# EAGLE design Adafruit Motor HAT rev A (EAGLE 6.4)

## Sheet 1 of 2
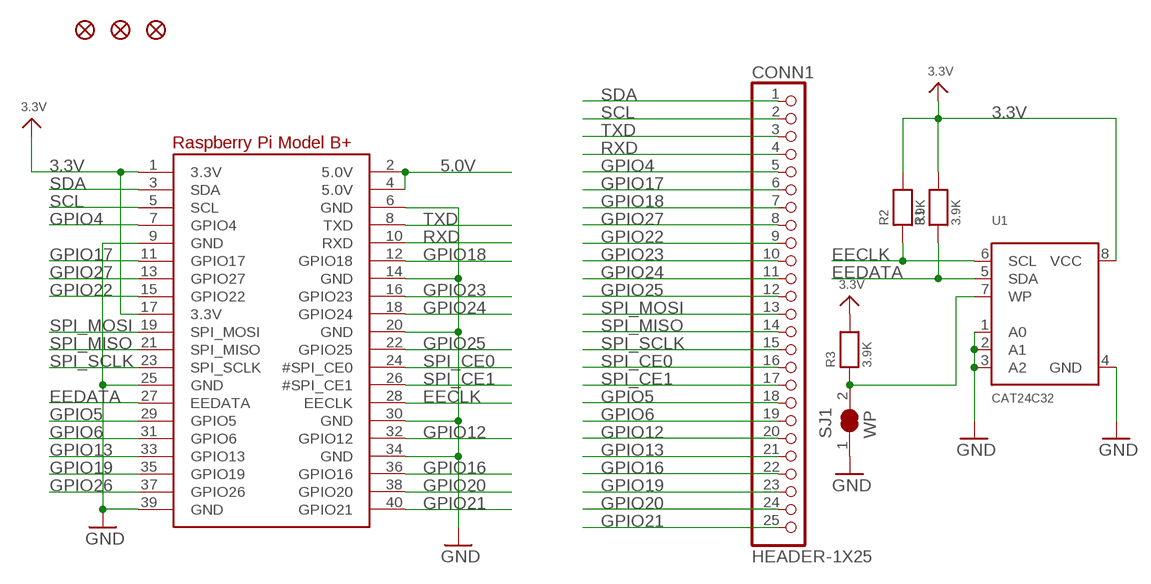
[diagram p0: schematic, sheet 1]

### Parts
CONN1  HEADER-1X25  [1X25_ROUND_70MIL]
FID1  FIDUCIAL""  [FIDUCIAL_1MM]
FID2  FIDUCIAL""  [FIDUCIAL_1MM]
FID3  FIDUCIAL""  [FIDUCIAL_1MM]
R1  3.9K  RESISTOR0805_NOOUTLINE  [0805-NO]
R2  3.9K  RESISTOR0805_NOOUTLINE  [0805-NO]
R3  3.9K  RESISTOR0805_NOOUTLINE  [0805-NO]
RPI1  RASPBERRYPI_BPLUS_HATSLOTS  [PI_HAT_SLOTS]
SJ1  WP  SOLDERJUMPER_CLOSED  [SOLDERJUMPER_CLOSEDWIRE]
U1  CAT24C32  EEPROM_I2C_SOIC8_GENERIC  [SOIC8_150MIL]

### Nets
3.3V: R1.2 R2.2 R3.2 RPI1.1(3.3V) RPI1.17(3.3V) U1.8(VCC) ; also sheet 2
5.0V: RPI1.2(5.0V) RPI1.4(5.0V)
EECLK: R2.1 RPI1.28(EECLK) U1.6(SCL)
EEDATA: R1.1 RPI1.27(EEDATA) U1.5(SDA)
GND: RPI1.6(GND) RPI1.9(GND) RPI1.14(GND) RPI1.20(GND) RPI1.25(GND) RPI1.30(GND) RPI1.34(GND) RPI1.39(GND) SJ1.1 U1.1(A0) U1.2(A1) U1.3(A2) U1.4(GND) ; also sheet 2
GPIO4: CONN1.5 RPI1.7(GPIO4)
GPIO5: CONN1.18 RPI1.29(GPIO5)
GPIO6: CONN1.19 RPI1.31(GPIO6)
GPIO12: CONN1.20 RPI1.32(GPIO12)
GPIO13: CONN1.21 RPI1.33(GPIO13)
GPIO16: CONN1.22 RPI1.36(GPIO16)
GPIO17: CONN1.6 RPI1.11(GPIO17)
GPIO18: CONN1.7 RPI1.12(GPIO18)
GPIO19: CONN1.23 RPI1.35(GPIO19)
GPIO20: CONN1.24 RPI1.38(GPIO20)
GPIO21: CONN1.25 RPI1.40(GPIO21)
GPIO22: CONN1.9 RPI1.15(GPIO22)
GPIO23: CONN1.10 RPI1.16(GPIO23)
GPIO24: CONN1.11 RPI1.18(GPIO24)
GPIO25: CONN1.12 RPI1.22(GPIO25)
GPIO26: RPI1.37(GPIO26)
GPIO27: CONN1.8 RPI1.13(GPIO27)
N$16: R3.1 SJ1.2 U1.7(WP)
RXD: CONN1.4 RPI1.10(RXD)
SCL: CONN1.2 RPI1.5(SCL) ; also sheet 2
SDA: CONN1.1 RPI1.3(SDA) ; also sheet 2
SPI_CE0: CONN1.16 RPI1.24(#SPI_CE0)
SPI_CE1: CONN1.17 RPI1.26(#SPI_CE1)
SPI_MISO: CONN1.14 RPI1.21(SPI_MISO)
SPI_MOSI: CONN1.13 RPI1.19(SPI_MOSI)
SPI_SCLK: CONN1.15 RPI1.23(SPI_SCLK)
TXD: CONN1.3 RPI1.8(TXD)

## Sheet 2 of 2
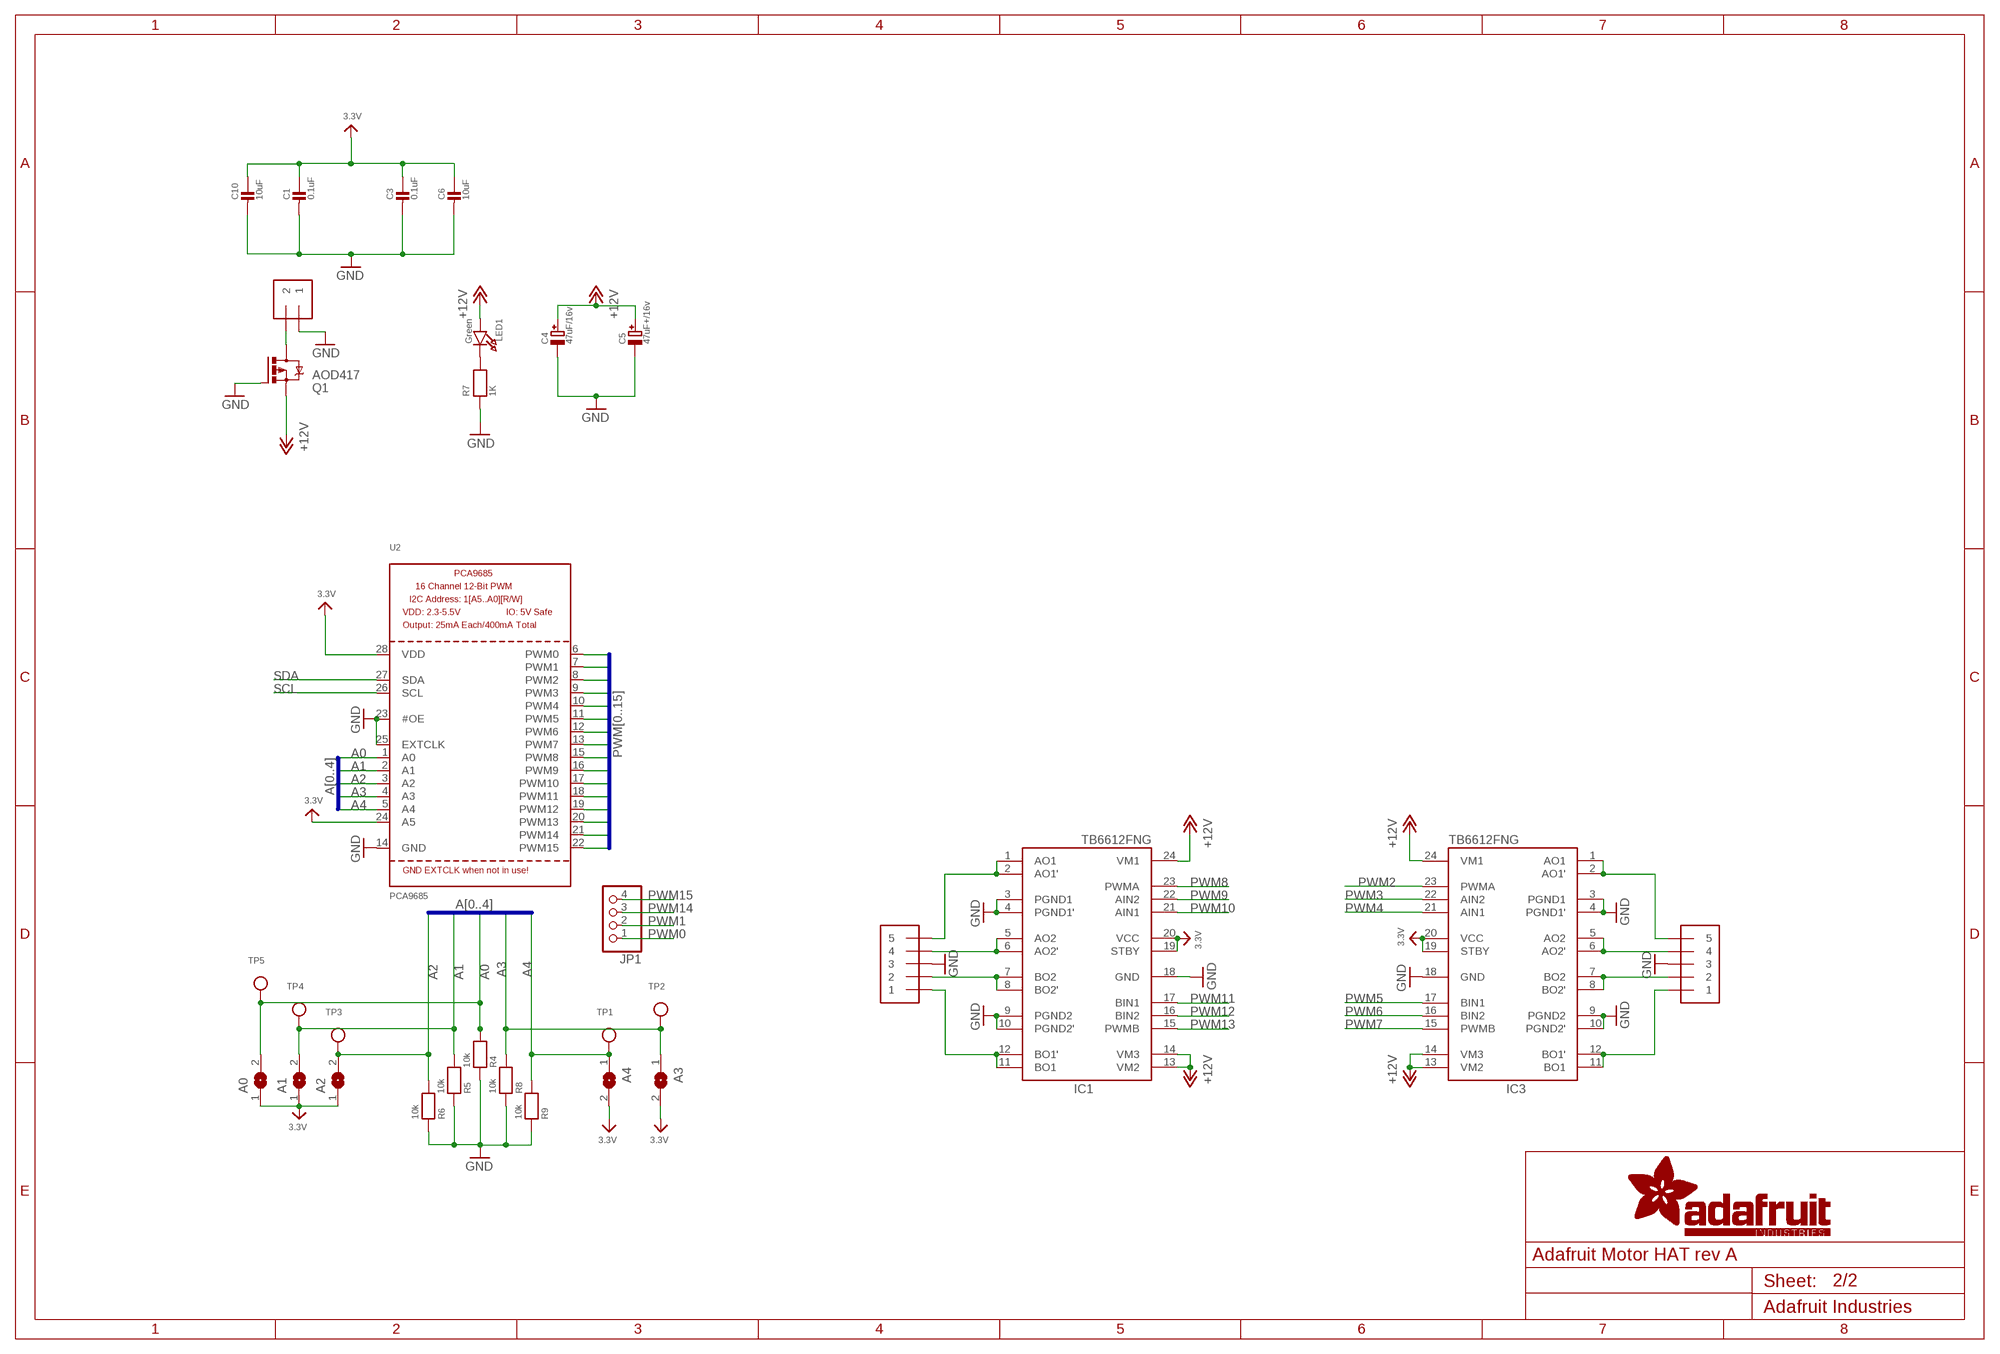
[diagram p1: schematic, sheet 2]

### Parts
A0  SOLDERJUMPERREFLOW_NOPASTE  [SOLDERJUMPER_REFLOW_NOPASTE]
A1  SOLDERJUMPERREFLOW_NOPASTE  [SOLDERJUMPER_REFLOW_NOPASTE]
A2  SOLDERJUMPERREFLOW_NOPASTE  [SOLDERJUMPER_REFLOW_NOPASTE]
A3  SOLDERJUMPERREFLOW_NOPASTE  [SOLDERJUMPER_REFLOW_NOPASTE]
A4  SOLDERJUMPERREFLOW_NOPASTE  [SOLDERJUMPER_REFLOW_NOPASTE]
C1  0.1uF  CAP_CERAMIC0805-NOOUTLINE  [0805-NO]
C3  0.1uF  CAP_CERAMIC0805-NOOUTLINE  [0805-NO]
C4  47uF/16v  CAP_ELECTROLYTICPANASONIC_C  [PANASONIC_C]
C5  47uF+/16v  CAP_ELECTROLYTICPANASONIC_C  [PANASONIC_C]
C6  10uF  CAP_CERAMIC0805-NOOUTLINE  [0805-NO]
C10  10uF  CAP_CERAMIC0805-NOOUTLINE  [0805-NO]
IC1  TB6612FNG  [SSOP24]
IC3  TB6612FNG  [SSOP24]
J1  1X5  [1X05-3.5MM]
J3  1X5  [1X05-3.5MM]
JP1  HEADER-1X476MIL  [1X04_ROUND_76]
LED1  Green  LED0805_NOOUTLINE  [CHIPLED_0805_NOOUTLINE]
MPOWER  1X2-3.5MM  [1X2-3.5MM]
Q1  AOD417  IRFR5305  [D-PAK_TO252AA]
R4  10k  RESISTOR0805_NOOUTLINE  [0805-NO]
R5  10k  RESISTOR0805_NOOUTLINE  [0805-NO]
R6  10k  RESISTOR0805_NOOUTLINE  [0805-NO]
R7  1K  RESISTOR0805_NOOUTLINE  [0805-NO]
R8  10k  RESISTOR0805_NOOUTLINE  [0805-NO]
R9  10k  RESISTOR0805_NOOUTLINE  [0805-NO]
TP1  TESTPOINTROUND2MM  [TESTPOINT_ROUND_2MM]
TP2  TESTPOINTROUND2MM  [TESTPOINT_ROUND_2MM]
TP3  TESTPOINTROUND2MM  [TESTPOINT_ROUND_2MM]
TP4  TESTPOINTROUND2MM  [TESTPOINT_ROUND_2MM]
TP5  TESTPOINTROUND2MM  [TESTPOINT_ROUND_2MM]
U2  PCA9685  [TSSOP28]

### Nets
3.3V: A0.1 A1.1 A2.1 A3.2 A4.2 C1.1 C3.1 C6.1 C10.1 IC1.19(STBY) IC1.20(VCC) IC3.19(STBY) IC3.20(VCC) U2.24(A5) U2.28(VDD) ; also sheet 1
+12V: C4.+ C5.+ IC1.13(VM2) IC1.14(VM3) IC1.24(VM1) IC3.13(VM2) IC3.14(VM3) IC3.24(VM1) LED1.A Q1.3(S)
A0: A0.2 R4.2 TP5.P$1 U2.1(A0)
A1: A1.2 R5.2 TP4.P$1 U2.2(A1)
A2: A2.2 R6.2 TP3.P$1 U2.3(A2)
A3: A3.1 R8.2 TP2.P$1 U2.4(A3)
A4: A4.1 R9.2 TP1.P$1 U2.5(A4)
GND: C1.2 C3.2 C4.- C5.- C6.2 C10.2 IC1.3(PGND1) IC1.4(PGND1') IC1.9(PGND2) IC1.10(PGND2') IC1.18(GND) IC3.3(PGND1) IC3.4(PGND1') IC3.9(PGND2) IC3.10(PGND2') IC3.18(GND) J1.3 J3.3 MPOWER.1 Q1.1(G) R4.1 R5.1 R6.1 R7.1 R8.1 R9.1 U2.14(GND) U2.23(#OE) U2.25(EXTCLK) ; also sheet 1
N$3: MPOWER.2 Q1.4(D)
N$4: IC1.1(AO1) IC1.2(AO1') J1.5
N$6: IC1.5(AO2) IC1.6(AO2') J1.4
N$7: IC1.7(BO2) IC1.8(BO2') J1.2
N$9: IC1.11(BO1) IC1.12(BO1') J1.1
N$12: IC3.1(AO1) IC3.2(AO1') J3.5
N$14: IC3.5(AO2) IC3.6(AO2') J3.4
N$15: IC3.7(BO2) IC3.8(BO2') J3.2
N$17: IC3.11(BO1) IC3.12(BO1') J3.1
N$133: LED1.C R7.2
PWM0: JP1.1 U2.6(PWM0)
PWM1: JP1.2 U2.7(PWM1)
PWM2: IC3.23(PWMA) U2.8(PWM2)
PWM3: IC3.22(AIN2) U2.9(PWM3)
PWM4: IC3.21(AIN1) U2.10(PWM4)
PWM5: IC3.17(BIN1) U2.11(PWM5)
PWM6: IC3.16(BIN2) U2.12(PWM6)
PWM7: IC3.15(PWMB) U2.13(PWM7)
PWM8: IC1.23(PWMA) U2.15(PWM8)
PWM9: IC1.22(AIN2) U2.16(PWM9)
PWM10: IC1.21(AIN1) U2.17(PWM10)
PWM11: IC1.17(BIN1) U2.18(PWM11)
PWM12: IC1.16(BIN2) U2.19(PWM12)
PWM13: IC1.15(PWMB) U2.20(PWM13)
PWM14: JP1.3 U2.21(PWM14)
PWM15: JP1.4 U2.22(PWM15)
SCL: U2.26(SCL) ; also sheet 1
SDA: U2.27(SDA) ; also sheet 1

### Buses
PWM[0..15]
A[0..4]

## Library data of the parts
A0 A1-A4 = microbuilder:SOLDERJUMPER: SMD Solder JUMPER Solder the two pads together to create a connection, or remove the solder to break it. REFLOW - Use this footprint for solder paste and reflow ovens. WAVE - Use this footprint for hand-soldering (larger pads). CLOSED - Has a trace between the two pads to ensure it is closed by default. The trace needs to be cut to disable the jumper, and can be closed again by creating a solder bridge between the two pads.
C1 C3 C6 C10 = microbuilder:CAP_CERAMIC: Ceramic Capacitors For new designs, use the packages preceded by an '_' character since they are more reliable: The following footprints should be used on most boards: _0402 - Standard footprint for regular board layouts _0603 - Standard footprint for regular board layouts _0805 - Standard footprint for regular board layouts For extremely tight-pitch boards where space is at a premium, the following 'micro-pitch' footprints can be used (smaller pads, no silkscreen outline, etc.): _0402MP - Micro-pitch footprint for very dense/compact boards _0603MP - Micro-pitch footprint for very dense/compact boards _0805MP - Micro-pitch footprint for very dense/compact boards Commonly Stocked Parts 0402 - 0402 Surface Mount Capacitors 16pF 50V 5% [Digikey: 445-4899-2-ND] 18pF 50V 5% [Digikey: 490-1281-2-ND] 22pF 50V 5% [Digikey: 490-1283-2-ND] 68pF 50V 5% [Digikey: 490-1289-2-ND] 0.1uF 10V 10% [Digikey: 490-1318-2-ND] 1.0uF 6.3V 10% [Digikey: 490-1320-2-ND] 0603 - 0603 Surface Mount Capacitors 16 pF 50V 5% [Digikey: 445-5051-2-ND] 22 pF 50V [Digikey: PCC220ACVTR-ND] 33 pF 50V 5% [Digikey: 490-1415-1-ND] 56pF 50V 5% [Digikey: 490-1421-1-ND] 220pF 50V 5% [Digikey: 445-1285-1-ND] 680 pF 50V 2200 pF 50V 5% C0G [Digikey: 445-1297-1-ND] 5600 pF 100V 5% X7R [Digikey: 478-3711-1-ND] 0.1 µF 25V 10% [Digikey: PCC2277TR-ND] 0.22 µF 16V 10% X7R [Digikey: 445-1318-1-ND] 1.0 µF 25V 10% [Digikey: 445-5146-2-ND] 0603 - RF Specific 3pF 250V +/-0.1pF RF [Digikey: 712-1347-1-ND] 18 pF 250V 5% [Digikey: 478-3505-1-ND or 712-1322-1-ND] 56 pF 250V 5% C0G RF [Digikey: 490-4867-1-ND] 68 pF 250V RF [Digikey: 490-4868-1-ND] 0805 - 0805 Surface Mount Capacitors 220 pF 250V 2% RF Ceramic Capacitor [Digikey: 712-1398-1-ND] 1000 pF 50V 2% NP0 Ceramic Capacitor [Digikey: 478-3760-1-ND] 0.1 µF 25V 10% Ceramic Capacitor [Digikey: PCC1828TR-ND] 1.0 µF 16V 10% Ceramic Capacitor[Digikey: 490-1691-2-ND] 10.0 µF 10V 10% Ceramic Capacitor[Digikey: 709-1228-1-ND] 10.0 uF 16V 10% Ceramic Capacitor [Digikey: 478-5165-2-ND] 47 uF 6.3V 20% Ceramic Capacitor [Digikey: 587-1779-1-ND or 399-5506-1-ND] 1206 - 1206 Surface Mount Capacitors 47uF 10V 20% Ceramic Capacitor [Digikey: 490-5528-1-ND or 399-5508-1-ND or 445-6010-1-ND] 100uF 6.3V -20%, +80% Y5V Ceramic Capacitor (Digikey: 490-4512-1-ND, Mouser: 81-GRM31CF50J107ZE1L)
C4 C5 = microbuilder:CAP_ELECTROLYTIC: Electrolytic Capacitors SMT PANASONIC_C - Size C Panasonic Electrolytic Aluminum Capacitor 47µF 16V 20% Electrolytic Capacitor [Digikey: PCE3890TR-ND] PANASONIC_D - Size D Panasonic Electrolytic Aluminum Capacitor 100µF 25V 20% Electrolytic Capacitor [Digikey: PCE3898TR-ND] PTH 3.5 mm grid, 8 mm diameter ... 3.5 mm grid, 10 mm diameter ...
CONN1 = microbuilder:HEADER-1X25
FID1-FID3 = microbuilder:FIDUCIAL: Fiducial Alignment Points Various fiducial points for machine vision alignment.; BOM: EXCLUDE
IC1 IC3 = adafruit:TB6612FNG: TB6612FNG MOS dual H-bridge motor driver, 1.2A current 3.2A peak 3 or 5v logic and 3-15v motor
J1 J3 = adafruit:1X5
JP1 = microbuilder:HEADER-1X4: PIN HEADER
LED1 = microbuilder:LED: LED 0603 - 0603 Surface Mount Package 2mA: Green LED - Low Power (3.9mcd, 2ma, 1.7Vf) - Digikey: 475-2709-2-ND Orange LED - Low Power (9.8mcd, 2ma, 1.8Vf) - Digikey: 475-1194-2-ND Red LED - Low Power (5mcd, 2ma, 1.8Vf) - Digikey: 475-1195-2-ND Yellow LED - Low Power (7mcd, 2ma, 1.8Vf) - Digikey: 475-1196-2-ND 5mA: Blue LED - Low Power (17mcd, 5ma, 2.9Vf) - Digikey: LNJ937W8CRACT-ND 0805 - 0805 Surface Mount Package 2mA: Red LED (8.8mcd, 2mA, 1.8Vf, Clear) - Low Power [Digikey: 475-2510-1-ND] Green LED (5mcd, 2mA, 1.8Vf, Clear) - Low Power [Digikey: 475-2730-1-ND] Yellow LED (11.3mcd, 2mA, 1.8Vf, Clear) - Low Power [Digikey: 475-2555-1-ND] 20mA: Red LED (104mcd, 20mA, Diffused) - LS R976 [Digikey: 475-1278-6-ND] Red LED (12mcd, 20mA, 2.0Vf, Clear) - APT2012EC [Digikey: 754-1128-1-ND] Green LED (15mcd, 20mA, 2.2Vf, Clear) - APT2012GC [Digikey: 754-1131-1-ND] Orange LED (160mcd, 20mA, 2.1Vf, Clear) - APT2012SECK [Digikey: 754-1130-1-ND] 1206 - 1206 Surface Mount Package Green LED (26mcd, 20mA, Diffused) - LG N971 [Digikey: 475-1407-6-ND] Red LED (15mcd, 20mA, Diffused) - LH N974 [Digikey: 475-1416-6-ND] Cree - Cree High-Power Surface Mount LEDs XPEBWT-L1-0000-00D50 - White 111lm 350mA 2.9Vf 6200K 110° XTEAWT-00-0000-00000LEE3 - White 114lm 350mA 2.85Vf 5000K 115° Everlight - Everlight 45-21 Series Surface Mount LEDs 45-21/QK2C-B2832AC2CB2/2T - Warm White 2000mcd 20mA 3.25Vf 3050K 120° 45-21/LK2C-B38452C4CB2/2T - Nuetral White 2000mcd 20mA 3.25Vf 4150K 120° 45-21/LK2C-B50634C6CB2/2T - Cold White 2200mcd 20mA 3.25Vf 5650K 120° PLCC2 Reverse Mount LS T77K-J1L2-1-0-2-R18-Z - Red 11.25mcd 2mA 1.8Vf 630nm 120° LO T77K-L1M2-24-Z - Orange 19.6mcd 2mA 1.8Vf 606nm 120° LY T77K-K2M1-26-Z - Yellow 15.7mcd 2mA 1.8Vf 587nm 120°
MPOWER = adafruit:1X2: 3.5mm Terminal block http://www.ladyada.net/library/pcb/eaglelibrary.html
Q1 = transistor-power:IRF?5305: HEXFET Power MOSFET Source: http://www.irf.com/product-info/datasheets/data/irfr5305pbf.pdf
R1-R9 = microbuilder:RESISTOR: Resistors For new designs, use the packages preceded by an '_' character since they are more reliable: The following footprints should be used on most boards: _0402 - Standard footprint for regular board layouts _0603 - Standard footprint for regular board layouts _0805 - Standard footprint for regular board layouts For extremely tight-pitch boards where space is at a premium, the following 'micro-pitch' footprints can be used (smaller pads, no silkscreen outline, etc.): _0402MP - Micro-pitch footprint for very dense/compact boards _0603MP - Micro-pitch footprint for very dense/compact boards _0805MP - Micro-pitch footprint for very dense/compact boards
RPI1 = microbuilder:RASPBERRYPI_BPLUS
SJ1 = microbuilder:SOLDERJUMPER_CLOSED: Solder Jumper - Closed These solder jumpers are closed by default CLOSEDWIRE - 10 mil trace between pads that can be cut and resoldered later CLOSEDPERM - 63 mil trace between pads for a permanent connection (used to 'bridge' two signals, a shameless hack for Eagle). Can double as a test point as well (no cream layer)
TP1-TP5 = microbuilder:TESTPOINT: Test Point Various test points for characterisation and PCB testing TESTPOINT_SMT - Compact Surface Mount Test Point [Digikey: 5016KTR-ND]
U1 = microbuilder:EEPROM_I2C_SOIC8_GENERIC: Note: The same pinout is used for many I2C EEPROMs in SOIC8(150mil) from a variety of manufacturers and in various sizes. Examples: 16K (2K x 8 Bit) I2C EEPROM 1.7-5.5V, 400KHz, -40°C-85°C Digikey: CAT24C16WI-GT3CT-ND 256K (32K x 8 Bit) I2C EEPROM 1.7-5.5V, 400KHz, -40°C-85°C Digikey: 24AA256-I/SN-ND
U2 = microbuilder:PCA9685: PCA9685 - 16 Channel 12-Bit I2C PWM Controller 5.0V tolerant 16 channel, 12-bit I2C PWM controller with 25mA per output (max. 400mA total) Digikey: 568-5931-1-ND

## Board
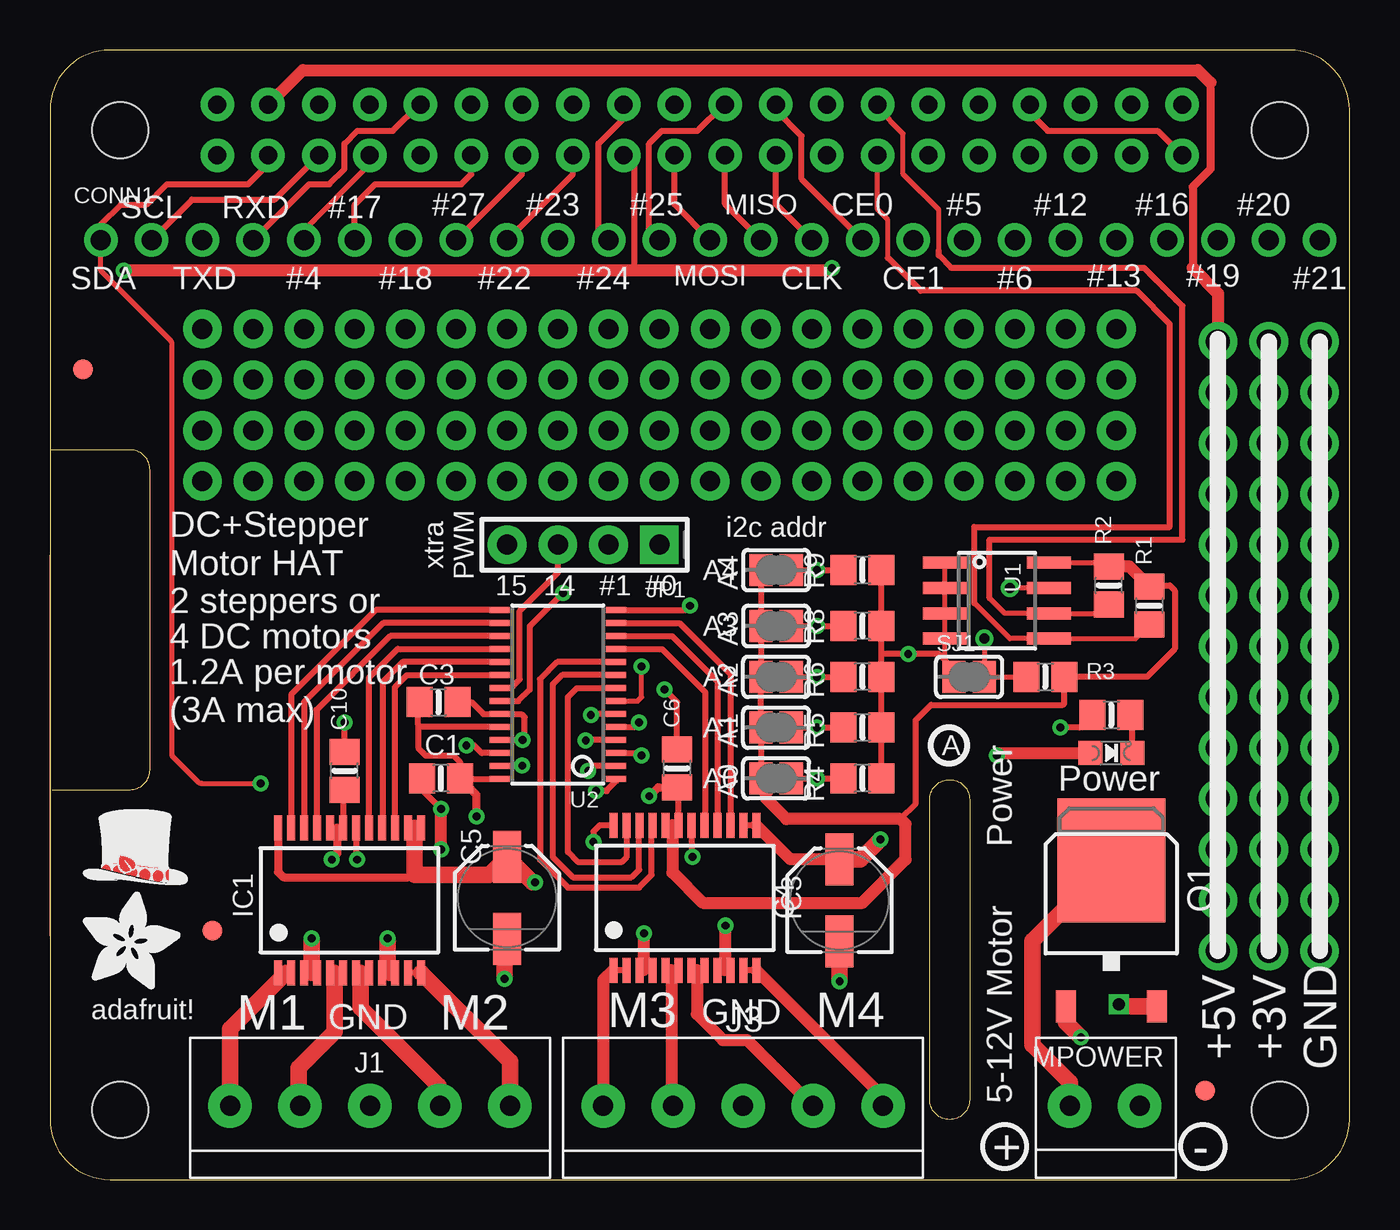
[diagram p2: board, top side]
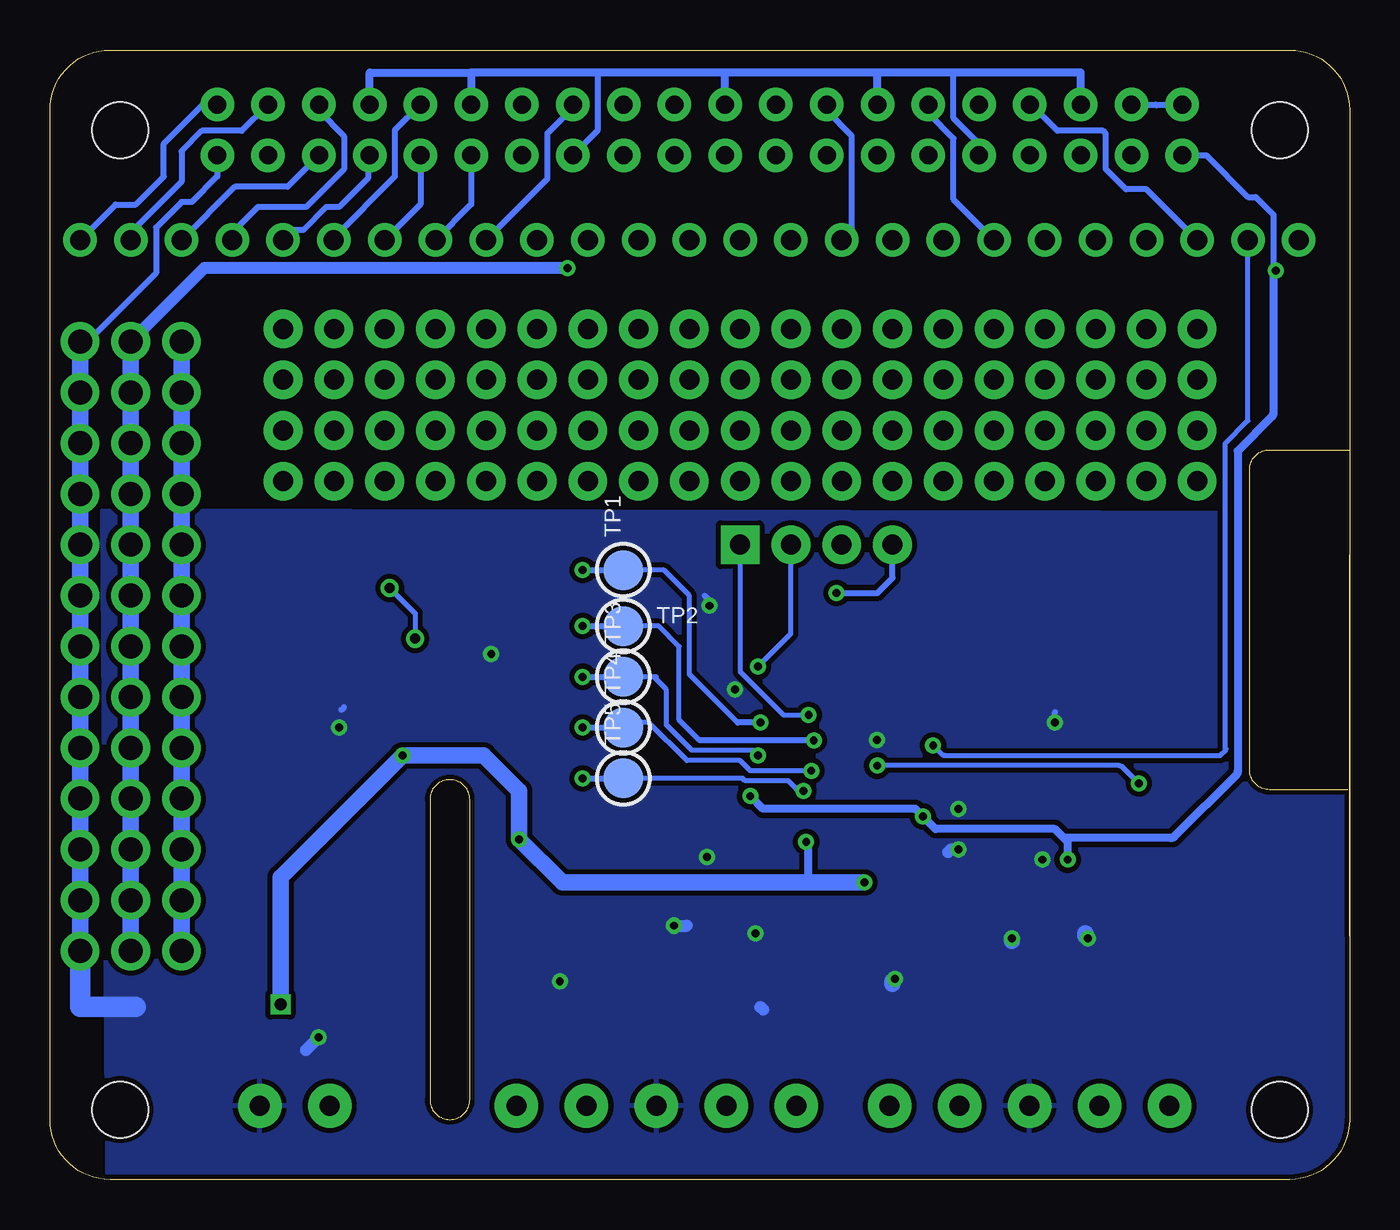
[diagram p3: board, bottom side, seen from below]

Size 65 x 56.5 mm. Coordinates in mm from the lower left corner, seen from the top.
Outline: 0,19.56 0,19.68
Outline: 0,12.19 0,31.24
Copper layers (1*16): Top 0.035mm / dielectric 1.5mm / Bottom 0.035mm
Design rules "adafruit *": minimum track width 8mil, minimum drill 15.5mil, track to track 8mil, track to pad 8mil, pad to pad 8mil, via to via 8mil, smd to smd 8mil, copper to edge 10mil, drill to drill 8mil, minimum pad ring 10mil, minimum via ring 8mil, stop-mask expansion 2mil, vias tented up to drill 20mil, thermal gap 10mil

### Footprints (pad centres in the part's own frame; a part is rotated, then mirrored left to right if it is on the bottom)
SOLDERJUMPER_REFLOW_NOPASTE = smd 1.168 x 1.6: 1 -0.762,0; 2 0.762,0
0805-NO = smd 1.3 x 1.5: 1 -0.95,0; 2 0.95,0
PANASONIC_C = smd 2.6 x 1.4: + 2.05,0; - -2.05,0
1X25_ROUND_70MIL = drill 1 pad 1.676: 1 -30.48,0; 2 -27.94,0; 3 -25.4,0; 4 -22.86,0; 5 -20.32,0; 6 -17.78,0; 7 -15.24,0; 8 -12.7,0; 9 -10.16,0; 10 -7.62,0; 11 -5.08,0; 12 -2.54,0; 13 0,0; 14 2.54,0; 15 5.08,0; 16 7.62,0; 17 10.16,0; 18 12.7,0; 19 15.24,0; 20 17.78,0; 21 20.32,0; 22 22.86,0; 23 25.4,0; 24 27.94,0; 25 30.48,0
FIDUCIAL_1MM = smd 1 x 1: 1 0,0
SSOP24 = smd 0.4 x 1.25: 1 -3.575,-3.625; 2 -2.925,-3.625; 3 -2.275,-3.625; 4 -1.625,-3.625; 5 -0.975,-3.625; 6 -0.325,-3.625; 7 0.325,-3.625; 8 0.975,-3.625; 9 1.625,-3.625; 10 2.275,-3.625; 11 2.925,-3.625; 12 3.575,-3.625; 13 3.575,3.625; 14 2.925,3.625; 15 2.275,3.625; 16 1.625,3.625; 17 0.975,3.625; 18 0.325,3.625; 19 -0.325,3.625; 20 -0.975,3.625; 21 -1.625,3.625; 22 -2.275,3.625; 23 -2.925,3.625; 24 -3.575,3.625
1X05-3.5MM = drill 1 pad 2.184: 1 7,0; 2 3.5,0; 3 0,0; 4 -3.5,0; 5 -7,0
1X04_ROUND_76 = drill 1 pad 1.93 square: 1 -3.81,0 | drill 1 pad 1.93: 2 -1.27,0; 3 1.27,0; 4 3.81,0
CHIPLED_0805_NOOUTLINE = smd 1.2 x 1.2: A 0,-1.05; C 0,1.05
1X2-3.5MM = drill 1 pad 2.184: 1 1.8,0; 2 -1.7,0
D-PAK_TO252AA = smd 1 x 1.6: 1 -2.28,-4.8; 3 2.28,-4.8 | smd 5.4 x 6.2: 4 0,2.5
PI_HAT_SLOTS = drill 0.9 pad 1.676: 1 8.37,51.23; 2 8.37,53.77; 3 10.91,51.23; 4 10.91,53.77; 5 13.45,51.23; 6 13.45,53.77; 7 15.99,51.23; 8 15.99,53.77; 9 18.53,51.23; 10 18.53,53.77; 11 21.07,51.23; 12 21.07,53.77; 13 23.61,51.23; 14 23.61,53.77; 15 26.15,51.23; 16 26.15,53.77; 17 28.69,51.23; 18 28.69,53.77; 19 31.23,51.23; 20 31.23,53.77; 21 33.77,51.23; 22 33.77,53.77; 23 36.31,51.23; 24 36.31,53.77; 25 38.85,51.23; 26 38.85,53.77; 27 41.39,51.23; 28 41.39,53.77; 29 43.93,51.23; 30 43.93,53.77; 31 46.47,51.23; 32 46.47,53.77; 33 49.01,51.23; 34 49.01,53.77; 35 51.55,51.23; 36 51.55,53.77; 37 54.09,51.23; 38 54.09,53.77; 39 56.63,51.23; 40 56.63,53.77 | hole 2.8: 3.5,3.5; 3.5,52.5; 61.5,52.5; 61.5,3.5
SOLDERJUMPER_CLOSEDWIRE = smd 1.168 x 1.6: 1 -0.762,0; 2 0.762,0 | smd 0.635 x 0.203: WIRE 0,0
TESTPOINT_ROUND_2MM = smd 2 x 2: P$1 0,0
SOIC8_150MIL = smd 0.6 x 2.2: 1 -1.905,-2.6; 2 -0.635,-2.6; 3 0.635,-2.6; 4 1.905,-2.6; 5 1.905,2.6; 6 0.635,2.6; 7 -0.635,2.6; 8 -1.905,2.6
TSSOP28 = smd 0.305 x 0.991: 1 -4.225,-2.918; 2 -3.575,-2.918; 3 -2.925,-2.918; 4 -2.275,-2.918; 5 -1.625,-2.918; 6 -0.975,-2.918; 7 -0.325,-2.918; 8 0.325,-2.918; 9 0.975,-2.918; 10 1.625,-2.918; 11 2.275,-2.918; 12 2.925,-2.918; 13 3.575,-2.918; 14 4.225,-2.918; 15 4.225,2.918; 16 3.575,2.918; 17 2.925,2.918; 18 2.275,2.918; 19 1.625,2.918; 20 0.975,2.918; 21 0.325,2.918; 22 -0.325,2.918; 23 -0.975,2.918; 24 -1.625,2.918; 25 -2.275,2.918; 26 -2.925,2.918; 27 -3.575,2.918; 28 -4.225,2.918

### Placement (x,y rotation side)
A0  36.32,20.07 0 top
A1  36.32,22.61 0 top
A2  36.32,25.15 0 top
A3  36.32,27.69 180 top
A4  36.32,30.48 180 top
C1  19.56,20.07 180 top
C3  19.43,23.88 0 top
C4  39.5,13.97 90 top
C5  22.86,14.1 90 top
C6  31.37,20.57 90 top
C10  14.73,20.45 90 top
CONN1  33.02,46.99 0 top
FID1  1.65,40.51 0 top
FID2  57.78,4.45 0 top
FID3  8.13,12.45 0 top
IC1  14.99,13.97 0 top
IC3  31.75,14.1 0 top
J1  16,3.68 0 top
J3  34.67,3.68 0 top
JP1  26.67,31.75 180 top
LED1  53.09,21.34 270 top
MPOWER  52.7,3.68 0 top
Q1  53.09,13.46 0 top
R1  54.99,28.7 90 top
R2  52.96,29.72 90 top
R3  49.78,25.15 0 top
R4  40.64,20.07 180 top
R5  40.64,22.61 180 top
R6  40.64,25.15 180 top
R7  53.09,23.24 0 top
R8  40.64,27.69 180 top
R9  40.64,30.48 180 top
RPI1  0,0 0 top
SJ1  45.97,25.15 0 top
TP1  36.32,30.48 90 bottom
TP2  36.32,27.69 0 bottom
TP3  36.32,25.15 90 bottom
TP4  36.32,22.61 90 bottom
TP5  36.32,20.07 90 bottom
U1  47.37,28.96 270 top
U2  25.4,24.26 90 top
U$5  [PIHATLOGO]  1.65,14.73 0 top
U$6  [PCBFEAT-REV-040]  44.96,21.72 0 top
U$51  [ADAFRUIT_5MM]  1.65,9.53 0 top

### Tracks (layer width: path | path; a pad name or v marks a point on that pad's centre or on a via)
3.3V  (via drill 0.39, 1.2 pad 1.93)
  Top 0.254: U1.8 52.77,30.86 R2.2 | 29.21,45.59 29.21,45.47
  Top 0.305: RPI1.17 29.21,50.71 29.21,45.59 | A4.2 A3.2 A2.1 A1.1 A0.1 | IC3.20 31.13,17.72 IC3.19 31.43,19.57 C6.1 | IC1.20 14.36,17.59 IC1.19 14.66,19.43 C10.1 | U2.24 18.52,22.63 18.41,22.73 | 18.41,22.73 18.41,23.81 C3.1 | U2.28 20.54,20.03 C1.1 20.51,20.89 20.19,21.21 18.8,21.21 18.41,21.59 18.41,22.73 | R1.2 55.06,29.72 56.01,29.72 56.26,29.46 56.26,26.54 54.86,25.15 R3.2 50.73,23.81 50.67,23.75 44.07,23.75 43.31,22.99 43.31,18.8 42.55,18.03
  Top 0.406: 14.36,17.59 14.36,16.26 v14.1,16 | v21.34,18.16 21.34,19.24 C1.1 | v29.97,19.18 30.42,19.62 C6.1
  Top 0.61: v3.68,45.47 29.21,45.47 38.99,45.47 v39.12,45.59 | R2.2 53.31,31.02 53.66,30.67 53.98,30.67 R1.2 | 31.13,17.72 31.13,15.36 32.64,13.84 40.64,13.84 42.8,16 42.8,17.78 42.55,18.03 36.83,18.03 35.81,19.05 35.81,19.81 A0.1 35.31,19.81
  Bottom 0.305: RPI1.1 7.16,51.23 5.08,49.15 4.7,49.15 3.81,48.26 3.81,45.47 v3.68,45.47 3.56,45.47 3.56,45.34
  Bottom 0.406: v14.1,16 14.1,16.89 14.29,17.08 | 14.29,17.08 14.73,17.53 20.7,17.53 v21.34,18.16 21.72,18.54 29.34,18.54 v29.97,19.18 | 3.81,45.47 3.81,38.33 arc45 3.88,38.15 5.59,36.45 5.59,20.43 arc45 5.66,20.25 8.75,17.16 arc45 8.93,17.08 14.29,17.08
  Bottom 0.61: v39.12,45.59 57.28,45.59 v60.96,41.91
  Bottom 0.813: v60.96,11.43 v60.96,13.97 v60.96,16.51 v60.96,19.05 v60.96,21.59 v60.96,24.13 v60.96,26.67 v60.96,29.21 v60.96,31.75 v60.96,34.29 v60.96,36.83 v60.96,39.37 v60.96,41.91
5.0V  (via drill 1.2 pad 1.93)
  Top 0.406: 58.04,54.86 58.04,50.55 57.15,49.66 57.15,45.59
  Top 0.61: RPI1.4 12.64,55.5 57.4,55.5 58.04,54.86 | 57.15,45.59 58.42,44.32 v58.42,41.91
  Bottom 0.305: RPI1.4 9.7,53.77 | 9.7,53.77 RPI1.2 | 9.7,53.77 9.65,53.72
  Bottom 0.813: v58.42,41.91 v58.42,39.37 v58.42,36.83 v58.42,34.29 v58.42,31.75 v58.42,29.21 v58.42,26.67 v58.42,24.13 v58.42,21.59 v58.42,19.05 v58.42,16.51 v58.42,13.97 v58.42,11.43
+12V  (via drill 0.39, 0.6)
  Top 0.305: IC3.13 IC3.14 | IC3.24 27.49,17.72 27.18,17.41 v27.18,16.89 | IC1.13 18.23,17.59 IC1.14 | 17.91,15.11 18.1,15.11 18.23,15.24
  Top 0.406: IC1.24 11.41,15.39 11.68,15.11 17.91,15.11
  Top 0.61: 53.57,8.66 v53.47,8.76 | v47.37,21.21 47.5,21.34 LED1.A | C5.+ 22.86,16 | C4.+ 37.03,16.02 IC3.13
  Top 0.813: Q1.3 53.57,8.66 | v41.53,17.02 40.53,16.02 C4.+ | 18.23,17.59 18.23,15.24 21.95,15.24 C5.+ 24.15,14.86 v24.26,14.86
  Bottom 0.406: 27.05,14.86 27.05,16.76 v27.18,16.89
  Bottom 0.813: v53.47,8.76 53.47,15.11 v47.37,21.21 43.31,21.21 41.53,19.43 v41.53,17.02 39.37,14.86 27.05,14.86 v24.26,14.86
A0  (via drill 0.39)
  Top 0.305: A0.2 v38.35,20.07 R4.2 | 27.84,19.43 27.81,19.43 | 27.81,19.43 v27.3,19.43 | U2.1 28.32,19.94 27.81,19.43
  Bottom 0.254: 27.69,19.56 28.07,19.94 30.23,19.94 30.35,20.07 TP5.P$1
  Bottom 0.305: v38.35,20.07 TP5.P$1 | 27.69,19.56 27.56,19.43 v27.3,19.43
A1  (via drill 0.39)
  Top 0.305: A1.2 v38.35,22.61 R5.2 | U2.2 27.16,20.68 v26.92,20.45
  Bottom 0.254: v26.92,20.45 29.97,20.45 30.48,20.95 33.15,20.95 35.05,22.86 36.07,22.86 TP4.P$1
  Bottom 0.305: v38.35,22.61 TP4.P$1
A2  (via drill 0.39)
  Top 0.305: A2.2 v38.35,25.15 R6.2 | U2.3 29.47,21.33 v29.59,21.21
  Bottom 0.254: v29.59,21.21 29.84,21.46 32.89,21.46 34.16,22.73 34.16,24.51 34.8,25.15 TP3.P$1 34.67,25.15
  Bottom 0.305: v38.35,25.15 TP3.P$1
A3  (via drill 0.39)
  Top 0.305: A3.1 v38.35,27.69 R8.2 | U2.4 26.81,21.98 v26.8,21.97
  Bottom 0.254: 32.51,21.97 33.53,22.99 33.53,26.67 34.54,27.69 TP2.P$1
  Bottom 0.305: v26.8,21.97 32.51,21.97 | v38.35,27.69 TP2.P$1
A4  (via drill 0.39)
  Top 0.305: A4.1 v38.35,30.48 R9.2 | U2.5 29.24,22.63 v29.46,22.86
  Bottom 0.254: 30.61,22.86 33.02,25.27 33.02,29.21 34.29,30.48 TP1.P$1
  Bottom 0.305: v29.46,22.86 30.61,22.86 | v38.35,30.48 TP1.P$1
EECLK
  Top 0.254: R2.1 52.51,28.32 U1.6 47.75,28.32 46.99,29.08 | 44.45,46.48 44.45,48.51 42.67,50.29 42.67,52.32 41.39,53.61 RPI1.28
  Top 0.305: 46.99,29.08 46.99,32 56.64,32 56.64,43.69 54.74,45.59 45.09,45.59 44.45,46.23 44.45,46.48
EEDATA
  Top 0.254: R1.1 54.29,27.05 U1.5 48.01,27.05 46.23,28.83 | 41.91,46.1 41.91,48.01 41.39,48.53 RPI1.27
  Top 0.305: 46.23,28.83 46.23,32.64 56.01,32.64 56.01,42.8 54.36,44.45 43.56,44.45 41.91,46.1
GND  (via drill 0.39, 1.2 pad 1.93)
  Top 0.254: 44.77,25.97 U1.4 U1.3 U1.2 U1.1
  Top 0.305: RPI1.34 49.01,53.35 49.91,52.45 55.41,52.45 RPI1.39 | IC3.4 29.71,10.47 IC3.3 | IC3.9 33.76,10.47 IC3.10 | R4.1 R5.1 R6.1 41.59,26.29 | 41.59,26.29 R8.1 R9.1 | U2.14 31.78,28.48 v32,28.7 | C6.2 31.37,23.88 v30.73,24.51 | IC1.9 16.95,10.34 IC1.10 | IC1.3 13.06,10.34 IC1.4 | C10.2 v14.73,22.86 | IC1.18 15.31,16 v15.37,16 | U2.25 v23.63,21.98 23.75,22.1 23.75,23.11 23.58,23.28 U2.23 21.68,23.28 21.08,23.88 C3.2 | C1.2 18.61,19.49 v19.56,18.54 | R7.1 51.5,22.61 v50.55,22.61 | 41.59,26.29 v42.93,26.29 44.45,26.29 44.77,25.97 45.21,25.53 SJ1.1 | IC3.18 32.08,16.18 v32.13,16.13
  Top 0.61: 29.71,10.47 29.71,10.55 29.72,10.56 v29.72,12.32 | v19.56,16.51 v19.56,18.54 | 33.76,10.47 33.78,10.49 v33.78,12.7
  Top 0.813: Q1.1 50.81,7.87 v51.56,7.11 | 13.06,10.34 13.08,10.37 v13.08,12.06 | 16.95,10.34 16.89,10.41 v16.89,12.06 | C5.- 22.73,11.92 v22.73,10.03 | C4.- v39.5,9.91
  Bottom 0.254: RPI1.25 39.12,50.96
  Bottom 0.305: 19.94,55.37 19.81,55.25 19.81,53.09 18.53,51.8 RPI1.9 18.53,51.04 | RPI1.25 37.59,52.49 37.59,55.37 | v32.13,16.13 31.88,16.13 | v32,28.7 32,28.96 32.26,29.21 | 50.42,23.5 50.29,23.62 | v14.73,22.86 14.73,23.37 | v15.37,16 15.11,16 | RPI1.39 56.63,50.18 57.91,48.9 58.42,48.9 59.69,47.62 59.69,45.34 63.12,41.91 v63.5,41.91 | v23.63,21.98 23.77,21.84 23.88,21.84
  Bottom 0.406: RPI1.34 49.01,55.37 43.94,55.37 | 43.94,55.37 43.94,53.77 RPI1.30 | RPI1.20 31.23,55.37 | 31.23,55.37 37.59,55.37 43.94,55.37 | RPI1.14 23.61,55.37 | 23.61,55.37 31.23,55.37 | RPI1.6 13.45,55.37 19.94,55.37 23.61,55.37
  Bottom 0.61: v51.56,7.11 52.2,6.48 | 29.46,8.64 29.34,8.51 | v33.78,12.7 33.15,12.7 | v19.56,16.51 19.94,16.51 20.07,16.38
  Bottom 0.813: v63.5,11.43 v63.5,13.97 v63.5,16.51 v63.5,19.05 v63.5,21.59 v63.5,24.13 v63.5,26.67 v63.5,29.21 v63.5,31.75 v63.5,34.29 v63.5,36.83 v63.5,39.37 v63.5,41.91 | v13.08,12.06 13.21,12.19 13.21,12.32 | v16.89,12.06 16.89,11.94 | v22.73,10.03 22.86,9.91 22.86,9.78
  Bottom 1.016: v63.5,11.43 63.5,8.64 60.71,8.64
  pour Bottom (isolate 0.254): -0.25,0.13 0,33.3 62.4,33.43 62.14,0.25
GPIO4
  Top 0.254: 15.99,50.79 12.7,47.5 CONN1.5
  Top 0.305: 15.99,50.79 RPI1.7
GPIO5
  Bottom 0.305: RPI1.29 43.93,48.78 CONN1.18
GPIO6
  Bottom 0.305: RPI1.31 46.47,48.78 CONN1.19
GPIO12
  Bottom 0.305: RPI1.32 47.75,52.49 47.75,50.17 50.8,47.12 CONN1.20
GPIO13
  Bottom 0.305: RPI1.33 49.1,51.23 49.1,50.09 50.55,48.64 51.18,48.64 52.32,47.5 52.83,47.5 CONN1.21
GPIO16
  Bottom 0.305: RPI1.36 51.55,53.46 50.29,52.2 50.29,50.55 52.2,48.64 54.61,48.64 55.88,47.37 CONN1.22
GPIO17
  Top 0.305: CONN1.6 15.24,48.77 16.26,49.78 20.57,49.78 21.07,50.28 RPI1.11
GPIO18
  Bottom 0.305: CONN1.7 19.81,49.02 19.81,52.07 21.07,53.33 RPI1.12
GPIO19
  Bottom 0.305: RPI1.35 53.12,49.66 55.75,49.66 CONN1.23
GPIO20
  Bottom 0.305: RPI1.38 55.41,52.45 57.4,52.45 58.42,51.44 58.42,49.91 60.96,47.37 CONN1.24
GPIO21
  Bottom 0.305: CONN1.25 61.72,48.77 60.71,48.77 59.31,50.17 59.31,51.82 57.4,53.72 56.68,53.72 RPI1.40
GPIO22
  Top 0.305: CONN1.9 26.15,50.28 RPI1.15
GPIO23
  Bottom 0.305: CONN1.10 24.89,47.5 24.89,52.2 26.15,53.46 RPI1.16
GPIO24
  Top 0.305: CONN1.11 27.43,47.5 27.43,51.82 28.69,53.07 RPI1.18
GPIO25
  Top 0.305: CONN1.12 29.97,47.5 29.97,51.82 30.61,52.45 32.38,52.45 33.7,53.77 RPI1.22
GPIO27
  Top 0.305: CONN1.8 23.61,50.28 RPI1.13
N$2  (via drill 1 pad 1.93)
  other vias: 53.34,42.55
N$3
  Top 0.61: 52.58,15.37 52.58,15.45 Q1.4
  Top 0.813: MPOWER.2 51.01,4.88 49.15,6.73 49.15,11.94 52.58,15.37
N$4
  Top 0.305: IC1.2 11.81,10.34 IC1.1
  Top 0.813: 11.81,10.34 9,7.54 J1.5
N$5  (via drill 1 pad 1.93)
  other vias: 53.34,40.01
N$6
  Top 0.305: IC1.5 14.24,10.34 IC1.6
  Top 0.813: 14.24,10.34 14.24,7.38 12.45,5.59 12.45,3.74 J1.4
N$7
  Top 0.305: IC1.8 15.54,10.34 IC1.7
  Top 0.813: 15.54,10.34 15.54,8.59 19.43,4.7 19.43,3.75 J1.2
N$8  (via drill 1 pad 1.93)
  other vias: 53.34,37.47
N$9
  Top 0.305: IC1.12 IC1.11
  Top 0.813: IC1.12 23,5.9 J1.1
N$10  (via drill 1 pad 1.93)
  other vias: 53.34,34.93
N$11  (via drill 1 pad 1.93)
  other vias: 50.8,42.55
N$12
  Top 0.305: IC3.2 IC3.1
  Top 0.61: IC3.1 27.67,9.97 J3.5
N$13  (via drill 1 pad 1.93)
  other vias: 50.8,40.01
N$14
  Top 0.305: IC3.5 31.09,10.47 IC3.6
  Top 0.61: 31.09,10.47 31.09,3.77 J3.4
N$15
  Top 0.305: IC3.8 32.35,10.47 IC3.7
  Top 0.61: 32.35,10.47 32.35,8.29 33.66,6.98 34.87,6.98 J3.2
N$16  (via drill 0.5)
  Top 0.254: R3.1 SJ1.2 v46.74,27.05 | U1.7 v48.01,29.59
  Bottom 0.254: v48.01,29.59 46.74,28.32 v46.74,27.05
N$17
  Top 0.305: IC3.12 IC3.11
  Top 0.61: IC3.12 41.67,4.13 J3.1
N$18  (via drill 1 pad 1.93)
  other vias: 50.8,37.47
N$19  (via drill 1 pad 1.93)
  other vias: 50.8,34.93
N$20  (via drill 1 pad 1.93)
  other vias: 48.26,34.93
N$21  (via drill 1 pad 1.93)
  other vias: 48.26,37.47
N$22  (via drill 1 pad 1.93)
  other vias: 48.26,40.01
N$23  (via drill 1 pad 1.93)
  other vias: 48.26,42.55
N$24  (via drill 1 pad 1.93)
  other vias: 45.72,42.55
N$25  (via drill 1 pad 1.93)
  other vias: 45.72,40.01
N$26  (via drill 1 pad 1.93)
  other vias: 45.72,37.47
N$27  (via drill 1 pad 1.93)
  other vias: 45.72,34.93
N$28  (via drill 1 pad 1.93)
  other vias: 43.18,34.93
N$29  (via drill 1 pad 1.93)
  other vias: 43.18,37.47
N$30  (via drill 1 pad 1.93)
  other vias: 43.18,40.01
N$31  (via drill 1 pad 1.93)
  other vias: 43.18,42.55
N$32  (via drill 1 pad 1.93)
  other vias: 40.64,42.55
N$33  (via drill 1 pad 1.93)
  other vias: 40.64,40.01
N$34  (via drill 1 pad 1.93)
  other vias: 40.64,37.47
N$35  (via drill 1 pad 1.93)
  other vias: 40.64,34.93
N$36  (via drill 1 pad 1.93)
  other vias: 38.1,34.93
N$37  (via drill 1 pad 1.93)
  other vias: 38.1,37.47
N$38  (via drill 1 pad 1.93)
  other vias: 38.1,40.01
N$39  (via drill 1 pad 1.93)
  other vias: 38.1,42.55
N$40  (via drill 1 pad 1.93)
  other vias: 35.56,42.55
N$41  (via drill 1 pad 1.93)
  other vias: 35.56,40.01
N$42  (via drill 1 pad 1.93)
  other vias: 35.56,37.47
N$43  (via drill 1 pad 1.93)
  other vias: 35.56,34.93
N$44  (via drill 1 pad 1.93)
  other vias: 33.02,34.93
N$45  (via drill 1 pad 1.93)
  other vias: 33.02,37.47
N$46  (via drill 1 pad 1.93)
  other vias: 33.02,40.01
N$47  (via drill 1 pad 1.93)
  other vias: 33.02,42.55
N$48  (via drill 1 pad 1.93)
  other vias: 30.48,42.55
N$49  (via drill 1 pad 1.93)
  other vias: 30.48,40.01
N$50  (via drill 1 pad 1.93)
  other vias: 30.48,37.47
N$51  (via drill 1 pad 1.93)
  other vias: 30.48,34.93
N$52  (via drill 1 pad 1.93)
  other vias: 27.94,34.93
N$53  (via drill 1 pad 1.93)
  other vias: 27.94,37.47
N$54  (via drill 1 pad 1.93)
  other vias: 27.94,40.01
N$55  (via drill 1 pad 1.93)
  other vias: 27.94,42.55
N$56  (via drill 1 pad 1.93)
  other vias: 25.4,42.55
N$57  (via drill 1 pad 1.93)
  other vias: 25.4,40.01
N$58  (via drill 1 pad 1.93)
  other vias: 25.4,37.47
N$59  (via drill 1 pad 1.93)
  other vias: 25.4,34.93
N$60  (via drill 1 pad 1.93)
  other vias: 22.86,34.93
N$61  (via drill 1 pad 1.93)
  other vias: 22.86,37.47
N$62  (via drill 1 pad 1.93)
  other vias: 22.86,40.01
N$63  (via drill 1 pad 1.93)
  other vias: 22.86,42.55
N$64  (via drill 1 pad 1.93)
  other vias: 20.32,42.55
N$65  (via drill 1 pad 1.93)
  other vias: 20.32,40.01
N$66  (via drill 1 pad 1.93)
  other vias: 20.32,37.47
N$67  (via drill 1 pad 1.93)
  other vias: 20.32,34.93
N$68  (via drill 1 pad 1.93)
  other vias: 17.78,34.93
N$69  (via drill 1 pad 1.93)
  other vias: 17.78,37.47
N$70  (via drill 1 pad 1.93)
  other vias: 17.78,40.01
N$71  (via drill 1 pad 1.93)
  other vias: 17.78,42.55
N$72  (via drill 1 pad 1.93)
  other vias: 15.24,42.55
N$73  (via drill 1 pad 1.93)
  other vias: 15.24,40.01
N$74  (via drill 1 pad 1.93)
  other vias: 15.24,37.47
N$75  (via drill 1 pad 1.93)
  other vias: 15.24,34.93
N$76  (via drill 1 pad 1.93)
  other vias: 12.7,34.93
N$77  (via drill 1 pad 1.93)
  other vias: 12.7,37.47
N$78  (via drill 1 pad 1.93)
  other vias: 12.7,40.01
N$79  (via drill 1 pad 1.93)
  other vias: 12.7,42.55
N$80  (via drill 1 pad 1.93)
  other vias: 10.16,42.55
N$81  (via drill 1 pad 1.93)
  other vias: 10.16,40.01
N$82  (via drill 1 pad 1.93)
  other vias: 10.16,37.47
N$83  (via drill 1 pad 1.93)
  other vias: 10.16,34.93
N$84  (via drill 1 pad 1.93)
  other vias: 7.62,34.93
N$85  (via drill 1 pad 1.93)
  other vias: 7.62,37.47
N$86  (via drill 1 pad 1.93)
  other vias: 7.62,40.01
N$87  (via drill 1 pad 1.93)
  other vias: 7.62,42.55
N$133
  Top 0.305: LED1.C 54.14,23.14 R7.2
PWM0  (via drill 0.39)
  Top 0.305: U2.6 27.09,23.28 v27.05,23.24
  Bottom 0.254: JP1.1 30.48,25.4 28.32,23.24 v27.05,23.24
PWM1  (via drill 0.39)
  Top 0.254: U2.7 29.39,23.93 29.59,24.13 v29.59,25.65
  Bottom 0.254: v29.59,25.65 27.94,27.3 JP1.2
PWM2
  Top 0.305: IC3.23 28.82,16.12 28.57,15.88 26.42,15.88 25.91,16.38 25.91,24.13 26.36,24.58 U2.8
PWM3
  Top 0.305: U2.9 25.61,25.23 25.15,24.77 25.15,16.13 26.16,15.11 29.08,15.11 29.46,15.49 29.46,17.71 IC3.22
PWM4
  Top 0.305: U2.10 25.37,25.88 24.51,25.02 24.51,16 25.91,14.61 29.46,14.61 30.1,15.24 30.1,17.7 IC3.21
PWM5
  Top 0.305: U2.11 30.62,26.53 32.77,24.38 32.77,17.76 IC3.17
PWM6
  Top 0.305: U2.12 31.11,27.18 33.38,24.92 IC3.16
PWM7
  Top 0.305: U2.13 31.48,27.83 34.02,25.28 IC3.15
PWM8
  Top 0.305: U2.15 16.29,28.48 12.06,24.26 IC1.23
PWM9
  Top 0.305: U2.16 16.66,27.83 12.7,23.88 12.7,17.61 IC1.22
PWM10
  Top 0.305: U2.17 17.02,27.18 13.34,23.5 13.34,17.62 IC1.21
PWM11
  Top 0.305: IC1.17 15.96,25.11 17.4,26.54 22.47,26.54 U2.18
PWM12
  Top 0.305: U2.19 17.63,25.88 16.64,24.89 16.64,17.62 IC1.16
PWM13
  Top 0.305: IC1.15 17.26,24.63 17.87,25.23 U2.20
PWM14
  Top 0.305: U2.21 23.06,24.58 23.5,25.02 23.5,28.45 25.4,30.35 JP1.3
PWM15  (via drill 0.39)
  Top 0.305: U2.22 23.42,23.93 24,24.51 24,27.69 v25.65,29.34
  Bottom 0.305: v25.65,29.34 23.62,29.34 22.86,30.1 JP1.4
RXD
  Top 0.305: CONN1.4 12.95,49.78 13.97,49.78 14.73,50.55 14.73,51.82 15.37,52.45 17.14,52.45 18.46,53.77 RPI1.10
SCL  (via drill 0.39)
  Top 0.305: CONN1.2 7.11,49.02 11.24,49.02 RPI1.5 | U2.26 21.59,21.33 21.21,21.72 v20.83,21.72
  Bottom 0.254: v20.83,21.72 20.39,21.28 arc-45 20.21,21.21 6.48,21.21 6.17,21.52 arc-45 6.22,21.57 6.22,36.81 5.08,37.95 CONN1.2
SDA  (via drill 0.39)
  Top 0.254: CONN1.1 2.54,45.47 6.02,41.98 arc-45 6.1,41.8 6.1,21.21 7.42,19.89 arc45 7.6,19.81 v10.54,19.81
  Top 0.305: CONN1.1 2.54,47.75 3.56,48.77 4.83,48.77 5.84,49.78 9.91,49.78 10.91,50.79 RPI1.3 | U2.27 22.5,20.7 v23.62,20.7
  Bottom 0.254: v10.54,19.81 11.36,20.63 arc-45 11.54,20.7 v23.62,20.7
SPI_CE0
  Top 0.305: CONN1.16 37.59,50.04 37.59,52.2 36.31,53.48 RPI1.24
SPI_CE1
  Bottom 0.305: RPI1.26 38.85,53.61 40.13,52.32 40.13,50.04 CONN1.17
SPI_MISO
  Top 0.305: CONN1.14 33.77,48.78 RPI1.21
SPI_MOSI
  Top 0.305: CONN1.13 31.23,48.78 RPI1.19
SPI_SCLK
  Top 0.305: CONN1.15 36.31,48.78 RPI1.23
TXD
  Bottom 0.305: CONN1.3 10.16,49.53 11.18,49.53 12.19,50.55 12.19,52.32 12.32,52.45 14.61,52.45 15.92,53.77 RPI1.8

### Text on the board
tPlace: SCL | RXD | #17 | #27 | #23 | #25 | MISO | CE0 | #5 | #12 | #16 | #20 | SDA | TXD | #4 | #18 | #22 | #24 | MOSI | CLK | CE1 | #6 | #13 | #19 | #21 | i2c addr | xtra / PWM | DC+Stepper / Motor HAT | 15 | 14 | #1 | #0 | A4 | 2 steppers or | A3 | 4 DC motors | A2 | 1.2A per motor | (3A max) | A1 | A0 | Power | Power | adafruit! | M1 | M2 | M3 | GND | M4 | GND | +5V | +3V | GND | 5-12V Motor | + | -